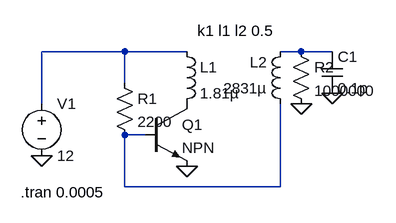
[diagram p0: schematic PerfectSlayer Exciter final.asc]
PerfectSlayer Exciter final.asc, the LTspice schematic file:
Version 4.1
SHEET 1 880 680
WIRE 16 96 -112 96
WIRE 112 96 16 96
WIRE 288 96 256 96
WIRE 336 96 288 96
WIRE 16 144 16 96
WIRE -112 176 -112 96
WIRE 48 224 16 224
WIRE 16 304 16 224
WIRE 256 304 256 176
WIRE 256 304 16 304
FLAG 336 160 0
FLAG -112 256 0
FLAG 112 272 0
FLAG 288 176 0
SYMBOL ind 96 80 R0
SYMATTR InstName L1
SYMATTR Value 1.81µ
SYMATTR Type ind
SYMBOL ind 272 192 R180
WINDOW 0 36 80 Left 2
WINDOW 3 36 40 Left 2
SYMATTR InstName L2
SYMATTR Value 2831µ
SYMATTR Type ind
SYMBOL cap 320 96 R0
SYMATTR InstName C1
SYMATTR Value 0.1p
SYMBOL res 0 128 R0
SYMATTR InstName R1
SYMATTR Value 2200
SYMBOL voltage -112 160 R0
WINDOW 123 0 0 Left 0
WINDOW 39 0 0 Left 0
SYMATTR InstName V1
SYMATTR Value 12
SYMBOL npn 48 176 R0
SYMATTR InstName Q1
SYMBOL res 272 80 R0
SYMATTR InstName R2
SYMATTR Value 1000000
TEXT 128 64 Left 2 !k1 l1 l2 0.5
TEXT -144 312 Left 2 !.tran 0.0005

The netlist it stands for:
* PerfectSlayer Exciter final.asc
L1 N001 P001 1.81µ
L2 N003 N002 2831µ
C1 N002 0 0.1p
R1 N001 N003 2200
V1 N001 0 12
Q1 P001 N003 0 0 NPN
R2 N002 0 1000000
.model NPN NPN
.model PNP PNP
.lib standard.bjt
k1 l1 l2 0.5
.tran 0.0005
.backanno
.end